# Altium schematic sheet DM0260_CCM.SchDoc: =project_title
size Tabloid; PageSetup: Record=PageOptions|CenterHorizontal=True|CenterVertical=True|PrintScale=0.71|XCorrection=1.00|YCorrection=1.00|PrintKind=0|BorderSize=5000000|LeftOffset=0|BottomOffset=0|Orientation=2|PaperLength=1000|PaperWidth=1000|Scale=100|PaperSource=7|PrintQuality=-4|MediaType=1|DitherType=10|PrintScaleMode=1|PaperKind=A4; CompanyName: Luxonis Holding; Organization: Luxonis Holding; Address1: 1925 Harmony Park Drive; Address2: Westminster, CO; Address3: 80234; Address4: United States; SheetNumber: 3; SheetTotal: 3
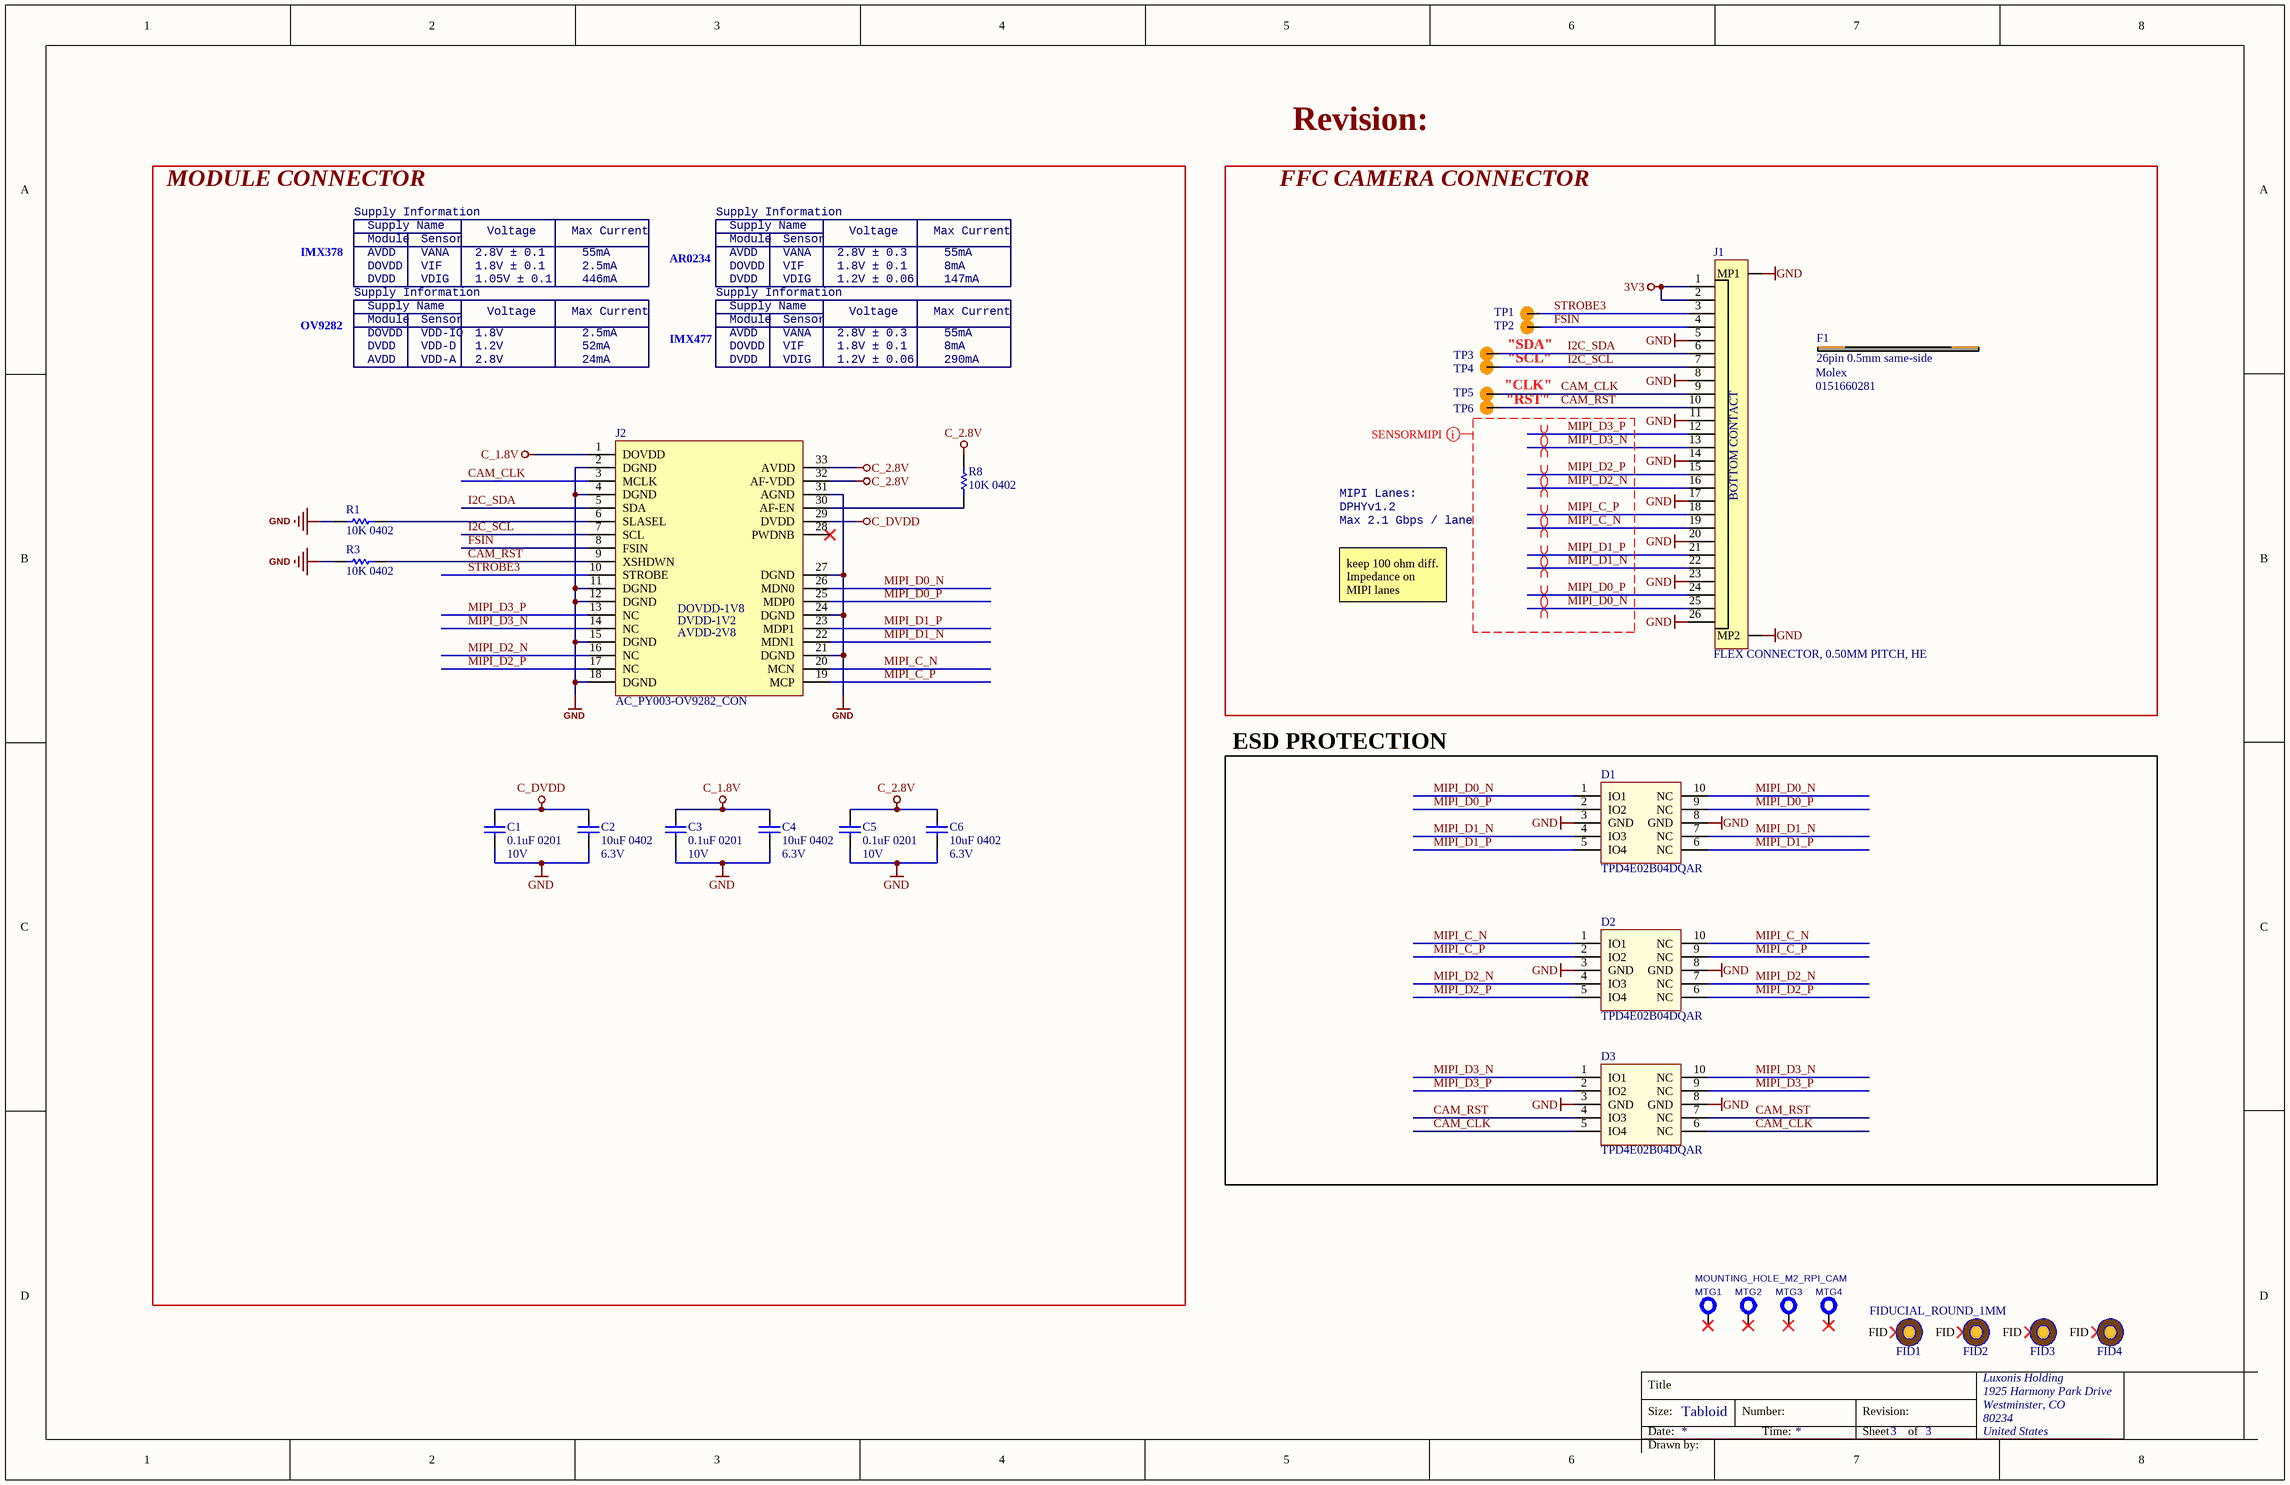
[diagram p0: DM0260_CCM.SchDoc]

## Parts
C1  0.1uF 0201  Voltage: 10V  [CAPC0201(0603)33_L]
C2  10uF 0402  Voltage Rating: 6.3V  [CAPC0402(1005)70_L]
C3  0.1uF 0201  Voltage: 10V  [CAPC0201(0603)33_L]
C4  10uF 0402  Voltage Rating: 6.3V  [CAPC0402(1005)70_L]
C5  0.1uF 0201  Voltage: 10V  [CAPC0201(0603)33_L]
C6  10uF 0402  Voltage Rating: 6.3V  [CAPC0402(1005)70_L]
D1  TPD4E02B04DQAR  [TPD4E02B04DQAR]
D2  TPD4E02B04DQAR  [TPD4E02B04DQAR]
D3  TPD4E02B04DQAR  [TPD4E02B04DQAR]
F1  26pin 0.5mm same-side  Manufacturer 1: Molex  (mechanical)
FID1  FIDUCIAL_ROUND_1MM  [FIDUCIAL_ROUND_1MM]  (no BOM)
FID2  FIDUCIAL_ROUND_1MM  [FIDUCIAL_ROUND_1MM]  (value not drawn)  (no BOM)
FID3  FIDUCIAL_ROUND_1MM  [FIDUCIAL_ROUND_1MM]  (value not drawn)  (no BOM)
FID4  FIDUCIAL_ROUND_1MM  [FIDUCIAL_ROUND_1MM]  (value not drawn)  (no BOM)
J1  FLEX CONNECTOR, 0.50MM PITCH, HE  [F32R-1A7H1-11026]
J2  AC_PY003-OV9282_CON  [AC-PY003-OV9282]
MTG1  MOUNTING_HOLE_M2_RPI_CAM  [MOUNTING_HOLE_M2_RPI_CAM]  (no BOM)
MTG2  MOUNTING_HOLE_M2_RPI_CAM  [MOUNTING_HOLE_M2_RPI_CAM]  (value not drawn)  (no BOM)
MTG3  MOUNTING_HOLE_M2_RPI_CAM  [MOUNTING_HOLE_M2_RPI_CAM]  (value not drawn)  (no BOM)
MTG4  MOUNTING_HOLE_M2_RPI_CAM  [MOUNTING_HOLE_M2_RPI_CAM]  (value not drawn)  (no BOM)
R1  10K 0402  [RESC0402(1005)_L]
R3  10K 0402  [RESC0402(1005)_L]
R8  10K 0402  [RESC0402(1005)_L]
TP1  TP100_200_NS  [TP100_200_NS]  (value not drawn)  (no BOM)
TP2  TP100_200_NS  [TP100_200_NS]  (value not drawn)  (no BOM)
TP3  TP100_200_NS  [TP100_200_NS]  (value not drawn)  (no BOM)
TP4  TP100_200_NS  [TP100_200_NS]  (value not drawn)  (no BOM)
TP5  TP100_200_NS  [TP100_200_NS]  (value not drawn)  (no BOM)
TP6  TP100_200_NS  [TP100_200_NS]  (value not drawn)  (no BOM)

## Blocks framed on the sheet
MODULE CONNECTOR: C1-C6 J2 R1 R3 R8
FFC CAMERA CONNECTOR: F1 J1 TP1-TP6
ESD PROTECTION: D1-D3

## Nets
3V3: J1.1 J1.2
C_1.8V: C3.2 C4.2 J2.1(DOVDD)
C_2.8V: C5.2 C6.2 J2.32(AF-VDD) J2.33(AVDD) R8.2
C_DVDD: C1.2 C2.2 J2.29(DVDD)
GND: C1.1 C2.1 C3.1 C4.1 C5.1 C6.1 D1.3(GND) D1.8(GND) D2.3(GND) D2.8(GND) D3.3(GND) D3.8(GND) J1.5 J1.8 J1.11 J1.14 J1.17 J1.20 J1.23 J1.26 J1.MP1 J1.MP2 J2.2(DGND) J2.4(DGND) J2.11(DGND) J2.12(DGND) J2.15(DGND) J2.18(DGND) J2.21(DGND) J2.24(DGND) J2.27(DGND) J2.31(AGND) R1.1 R3.1
CAM_CLK: D3.5(IO4) D3.6(NC) J1.9 J2.3(MCLK) TP5.1
CAM_RST: D3.4(IO3) D3.7(NC) J1.10 J2.9(XSHDWN) R3.2 TP6.1
FSIN: J1.4 J2.8(FSIN) TP2.1
I2C_SCL: J1.7 J2.7(SCL) TP4.1
I2C_SDA: J1.6 J2.5(SDA) TP3.1
MIPI_C_N: D2.1(IO1) D2.10(NC) J1.19 J2.20(MCN)
MIPI_C_P: D2.2(IO2) D2.9(NC) J1.18 J2.19(MCP)
MIPI_D0_N: D1.1(IO1) D1.10(NC) J1.25 J2.26(MDN0)
MIPI_D0_P: D1.2(IO2) D1.9(NC) J1.24 J2.25(MDP0)
MIPI_D1_N: D1.4(IO3) D1.7(NC) J1.22 J2.22(MDN1)
MIPI_D1_P: D1.5(IO4) D1.6(NC) J1.21 J2.23(MDP1)
MIPI_D2_N: D2.4(IO3) D2.7(NC) J1.16 J2.16(NC)
MIPI_D2_P: D2.5(IO4) D2.6(NC) J1.15 J2.17(NC)
MIPI_D3_N: D3.1(IO1) D3.10(NC) J1.13 J2.14(NC)
MIPI_D3_P: D3.2(IO2) D3.9(NC) J1.12 J2.13(NC)
STROBE3: J1.3 J2.10(STROBE) TP1.1
NetJ2_6: J2.6(SLASEL) R1.2
NetJ2_30: J2.30(AF-EN) R8.1

Not connected (* = marked no-connect by the designer): FID1 FID*; FID2 FID*; FID3 FID*; FID4 FID*; J2 28(PWDNB)*; MTG1 1*; MTG2 1*; MTG3 1*; MTG4 1*

## Layout directives
net class SENSORMIPI: MIPI_C_N, MIPI_C_P, MIPI_D0_N, MIPI_D0_P, MIPI_D1_N, MIPI_D1_P, MIPI_D2_N, MIPI_D2_P, MIPI_D3_N, MIPI_D3_P
differential pair; differential pair class 100ohm: MIPI_C_N, MIPI_C_P, MIPI_D0_N, MIPI_D0_P, MIPI_D1_N, MIPI_D1_P, MIPI_D2_N, MIPI_D2_P, MIPI_D3_N, MIPI_D3_P

## Notes on the sheet
- Revision:
- Supply Information
- Supply Name
- Voltage
- Max Current
- IMX378
- AVDD
- DOVDD
- DVDD
- Module
- VANA
- VIF
- VDIG
- Sensor
- 2.8V ± 0.1
- 1.8V ± 0.1
- 1.05V ± 0.1
- 55mA
- 2.5mA
- 446mA
- AR0234
- 2.8V ± 0.3
- 1.2V ± 0.06
- 8mA
- 147mA
- OV9282
- VDD-A
- VDD-IO
- VDD-D
- 2.8V
- 1.8V
- 1.2V
- 24mA
- 52mA
- IMX477
- 290mA
- "SCL"
- "SDA"
- "CLK"
- "RST"
- MIPI Lanes:
- Max 2.1 Gbps / lane
- DPHYv1.2
- keep 100 ohm diff. Impedance on MIPI lanes
- Title
- Size:
- Date:
- Tabloid
- Number:
- Time:
- Sheet
- of
- Drawn by:
- (in symbol CMP-005-000036-1) DOVDD-1V8; DVDD-1V2; AVDD-2V8
- (in symbol F32R-1A7H1-11026) BOTTOM CONTACT

## Library data of the parts
C1 C3 C5 = GRM033R61A104KE15D: CAP CER 0.1UF 10V X5R 0201; Manufacturer 1: Murata; Capacitance: 100nF; Tolerance: 10%; Supplier 1: Digi-Key; Manufacturer Part Number 1: GRM033R61A104KE15D; Stock 1: 45335312; Pricing 1: 1=0.10000, 10=0.04200, 100=0.01860, 500=0.01330, 1000=0.01045, 2500=0.00950, 5000=0.00874 (USD); RoHS: Yes; Mount: Surface Mount; Case/Package: 0201; Weight: 6E-06oz; Case Code (Metric): 0603; Case Code (Imperial): 0201; Min Operating Temperature: -55°C; Max Operating Temperature: 85°C; Packaging: Tape and Reel; Voltage Rating: 10V; Package Quantity: 1; Voltage Rating (DC): 10V; Dielectric: X5R; Termination: SMD/SMT; Length: 0.6mm; Height: 0.3mm; Width: 0.012inch; Thickness: 0.013inch; Depth: 0.3mm; Radiation Hardening: No; Lead Free: Lead Free; REACH SVHC: No SVHC; ComponentLink1URL: https://datasheet.ciiva.com/26843/getdatasheetpartid-308656-26843739.pdf?src-supplier=Verical; ComponentLink1Description: https://datasheet.ciiva.com/26843/getdatasheetpartid-308656-26843739.pdf?src-supplier=Verical; ComponentLink2URL: https://datasheet.ciiva.com/5413/product-5413117.pdf?src-supplier=Mouser; ComponentLink2Description: https://datasheet.ciiva.com/5413/product-5413117.pdf?src-supplier=Mouser; ComponentLink3URL: https://datasheet.ciiva.com/6256/partnumbering-e-01-6256406.pdf?src-supplier=Digi-Key; ComponentLink3Description: https://datasheet.ciiva.com/6256/partnumbering-e-01-6256406.pdf?src-supplier=Digi-Key; ComponentLink4URL: https://datasheet.ciiva.com/6256/partnumbering-e-01-6256407.pdf?src-supplier=Digi-Key; ComponentLink4Description: https://datasheet.ciiva.com/6256/partnumbering-e-01-6256407.pdf?src-supplier=Digi-Key; ComponentLink5URL: https://datasheet.ciiva.com/6256/partnumbering-e-01-6256408.pdf?src-supplier=Digi-Key; ComponentLink5Description: https://datasheet.ciiva.com/6256/partnumbering-e-01-6256408.pdf?src-supplier=Digi-Key; Supplier Part Number 1: 490-5881-1-ND
C2 C4 C6 = GRM155R60J106ME15D: CAP CER 10UF 6.3V X5R 0402 20%; Manufacturer 1: Murata; Supplier 1: Digi-Key; Manufacturer Part Number 1: GRM155R60J106ME15D; Stock 1: 1839627; Pricing 1: 1=0.23000, 10=0.15700, 100=0.07950, 500=0.05442, 1000=0.04814, 2500=0.04605, 5000=0.04186 (USD); RoHS: Yes; Mount: Surface Mount; Case/Package: 0402; Case Code (Metric): 1005; Case Code (Imperial): 0402; Min Operating Temperature: -55°C; Max Operating Temperature: 85°C; Packaging: Tape and Reel; Capacitance: 10uF; Dielectric: X5R; Length: 0.039inch; Width: 0.02inch; ComponentLink1URL: https://www.murata.com/~/media/webrenewal/support/library/catalog/products/capacitor/mlcc/c02e.ashx?la=en-us&src-supplier=Digi-Key; ComponentLink1Description: https://www.murata.com/~/media/webrenewal/support/library/catalog/products/capacitor/mlcc/c02e.ashx?la=en-us&src-supplier=Digi-Key; Supplier Part Number 1: 490-13238-1-ND; Voltage Rating (DC): 6.3V; Thickness: 0.026inch; Tolerance: 20%
D1-D3 = TPD4E02B04DQAR: TVS DIODE 3.6V 8.8V 10USON 8.8V (Typ) Clamp 5A (8/20µs) Ipp Tvs Diode Surface Mount 10-USON (2.5x1); Manufacturer 1: Texas Instruments; Number of Bidirectional Channels: 4; Min Breakdown Voltage: 5.5V; Peak Pulse Power: 17W; Power Line Protection: No; Interface: USB,HDMI; Supplier 1: Digi-Key; Manufacturer Part Number 1: TPD4E02B04DQAR; Stock 1: 25615; Pricing 1: 1=0.69000, 10=0.60800, 100=0.46650, 500=0.36874, 1000=0.29499 (USD); RoHS: Yes; Mount: Surface Mount; Number of Pins: 10; Min Operating Temperature: -40°C; Max Operating Temperature: 125°C; Packaging: Cut Tape; Reverse Standoff Voltage: 3.6V; Clamping Voltage: 8.8V; Operating Supply Voltage: 3.6V; Peak Pulse Current: 5A; Number of Channels: 4; Composition: Zener; REACH SVHC: No SVHC; Lead Free: Lead Free; ComponentLink1URL: http://www.ti.com/general/docs/lit/getliterature.tsp?genericPartNumber=TPD4E02B04&amp;&amp;fileType=pdf&src-supplier=Element14; ComponentLink1Description: http://www.ti.com/general/docs/lit/getliterature.tsp?genericPartNumber=TPD4E02B04&amp;&amp;fileType=pdf&src-supplier=Element14; ComponentLink2URL: http://www.ti.com/lit/ds/symlink/tpd4e02b04.pdf?src-supplier=Farnell; ComponentLink2Description: http://www.ti.com/lit/ds/symlink/tpd4e02b04.pdf?src-supplier=Farnell; ComponentLink3URL: http://www.ti.com/lit/ds/symlink/tpd4e02b04.pdf?src-supplier=Newark; ComponentLink3Description: http://www.ti.com/lit/ds/symlink/tpd4e02b04.pdf?src-supplier=Newark; ComponentLink4URL: http://www.ti.com/lit/ds/symlink/tpd4e02b04.pdf?src-supplier=Digi-Key; ComponentLink4Description: http://www.ti.com/lit/ds/symlink/tpd4e02b04.pdf?src-supplier=Digi-Key; Supplier Part Number 1: 296-43875-1-ND
F1 = 0151660281: CABLE FFC 26POS 0.50MM 6"; Number of Conductors: 26; Wire/Cable Type: Flat Flex; Pitch: 0.02inch; Supplier 1: Digi-Key; Manufacturer Part Number 1: 0151660281; Stock 1: 118; Pricing 1: 1=2.21000, 10=2.01000, 25=1.88680, 50=1.80460, 100=1.72260, 250=1.55856, 500=1.43552, 1000=1.23045, 2500=1.14842 (USD); RoHS: Yes; Number of Pins: 26; Packaging: Bulk; Package Quantity: 1000; Length: 6inch; Cable Pitch: 0.5mm; Radiation Hardening: No; ComponentLink1URL: https://datasheet.ciiva.com/10989/0151660281-cable-10989152.pdf?src-supplier=Avnet; ComponentLink1Description: https://datasheet.ciiva.com/10989/0151660281-cable-10989152.pdf?src-supplier=Avnet; ComponentLink2URL: https://datasheet.ciiva.com/2944/151660051-sd-2944673.pdf?src-supplier=Digi-Key; ComponentLink2Description: https://datasheet.ciiva.com/2944/151660051-sd-2944673.pdf?src-supplier=Digi-Key; Supplier 2: Mouser; Supplier Part Number 1: WM11334-ND; Supplier Part Number 2: 538-15166-0281
FID1-FID4 = FIDUCIAL: Fiducial with various available footprints
J1 = F32R-1A7H1-11026: 26 Position FFC, FPC Connector Contacts, Bottom 0.020" (0.50mm) Surface Mount, Right Angle; Manufacturer 1: Amphenol ICC (FCI); Number of Positions: 26; Voltage Rating: 50V; Current Rating: 500mA; Pitch: 0.02inch; Supplier 1: Digi-Key; Manufacturer Part Number 1: F32R-1A7H1-11026; RoHS: Yes; Category: Connectors; Pricing 1: 1=0.77, 10=0.721, 100=0.5529, 500=0.4808 (USD); Mount: Surface Mount; Contact Plating: Tin; Contact Material: Bronze; Min Operating Temperature: -40°C; Max Operating Temperature: 105°C; Packaging: Tape and Reel; Termination: Solder; Flammability Rating: UL94 V-0; ComponentLink1URL: https://cdn.amphenol-icc.com/media/wysiwyg/files/drawing/f32r-f32j.pdf; ComponentLink1Description: https://cdn.amphenol-icc.com/media/wysiwyg/files/drawing/f32r-f32j.pdf; Stock 1: 1709; Supplier Part Number 1: 609-F32R-1A7H1-11026CT-ND
J2 = CMP-005-000036-1: FFC/FPC Connector, 33 Contact(s), 1 Row(s), Female, Right Angle, Surface Mount Terminal; Manufacturer 1: Hirose; Manufacturer Part Number 1: FH26W-33S-0.3SHW(60); ComponentLink1Description: https://datasheet.ciiva.com:443/pdfs/VipMasterIC/IC/HIRO/HIRO-S-A0007913874/HIRO-S-A0008593114-1.pdf?src-supplier=IHS+Markit; ComponentLink3Description: https://www.hirose.com/product/download/?distributor=digikey&amp;type=2d&amp;lang=en&amp;num=FH26W-13S-0.3SHW(60)&src-supplier=Digi-Key; ComponentLink1URL: https://datasheet.ciiva.com:443/pdfs/VipMasterIC/IC/HIRO/HIRO-S-A0007913874/HIRO-S-A0008593114-1.pdf?src-supplier=IHS+Markit; Source: LuxonisMaster.SchLib; ComponentLink2Description: https://www.hirose.com/product/en/download_file/key_name/FH26/category/Catalog/doc_file_id/49355/?file_category_id=4&item_id=298&is_series=1&src-supplier=Digi-Key; Pricing 1: 1=1,78000, 10=1,61700, 25=1,51800, 50=1,45200, 100=1,38600, 250=1,25400, 500=1,15500, 1000=0,99000, 2500=0,92400 (USD); Category: FFC / FPC; Design Item ID: AC_PY003-OV9282_CON; ComponentLink2URL: https://www.hirose.com/product/en/download_file/key_name/FH26/category/Catalog/doc_file_id/49355/?file_category_id=4&item_id=298&is_series=1&src-supplier=Digi-Key; RoHS: Yes; Stock 1: 627; ComponentLink3URL: https://www.hirose.com/product/download/?distributor=digikey&amp;type=2d&amp;lang=en&amp;num=FH26W-13S-0.3SHW(60)&src-supplier=Digi-Key
MTG1-MTG4 = MP_Mounting-Holes: =CurrentFootprint; B - Value: Not a Part; A - Level: 0
R1 R3 R8 = RC0402FR-1310KL: RES SMD 10K OHM 1% 0402 1/16W Chip Resistor, 0402 [1005 Metric], 10 kohm, RC Series, 50 V, Thick Film, 62.5 mW; Manufacturer 1: Yageo; Resistance: 10kR; Temperature Coefficient: 100ppm/°C; Power Rating: 62.5mW; Voltage Rating: 50V; ComponentLink1URL: https://datasheet.ciiva.com/16940/pyu-rc0402-51-rohs-l-6-16940293.pdf?src-supplier=Avnet+Europe; ComponentLink1Description: https://datasheet.ciiva.com/16940/pyu-rc0402-51-rohs-l-6-16940293.pdf?src-supplier=Avnet+Europe; ComponentLink2URL: https://datasheet.ciiva.com/28386/pyu-rc0402-51-rohs-l-6-28386855.pdf?src-supplier=Avnet+Europe; ComponentLink2Description: https://datasheet.ciiva.com/28386/pyu-rc0402-51-rohs-l-6-28386855.pdf?src-supplier=Avnet+Europe; ComponentLink3URL: https://datasheet.ciiva.com/16740/pyu-rc0402-51-rohs-l-6-r-16740602.pdf?src-supplier=Future+Electronics; ComponentLink3Description: https://datasheet.ciiva.com/16740/pyu-rc0402-51-rohs-l-6-r-16740602.pdf?src-supplier=Future+Electronics; ComponentLink4URL: https://datasheet.ciiva.com/8891/pyu-rc0402-51-rohs-l-6-8891339.pdf?src-supplier=Avnet; ComponentLink4Description: https://datasheet.ciiva.com/8891/pyu-rc0402-51-rohs-l-6-8891339.pdf?src-supplier=Avnet; ComponentLink5URL: https://datasheet.ciiva.com/5557/pyu-rc0402-51-rohs-l-6-r-5557997.pdf?src-supplier=Mouser; ComponentLink5Description: https://datasheet.ciiva.com/5557/pyu-rc0402-51-rohs-l-6-r-5557997.pdf?src-supplier=Mouser; ComponentLink6URL: https://datasheet.ciiva.com/7983/1018594-7983533.pdf?src-supplier=Element14; ComponentLink6Description: https://datasheet.ciiva.com/7983/1018594-7983533.pdf?src-supplier=Element14; Supplier 1: Newark; Manufacturer Part Number 1: RC0402FR-1310KL; Stock 1: 62239; Pricing 1: 1=0.10000, 25=0.01200, 100=0.00400, 250=0.00400, 500=0.00300, 1000=0.00300 (USD); RoHS: Yes; Case/Package: 0402; Number of Pins: 2; Contact Plating: Tin,Matte,Lead; Case Code (Imperial): 0402; Case Code (Metric): 1005; Min Operating Temperature: -55°C; Max Operating Temperature: 155°C; Tolerance: 1%; Composition: Thick Film; Packaging: Tape and Reel; Termination: SMD/SMT; Military Standard: Not; Voltage Rating (DC): 50V; Working Voltage: 50V; Number of Terminations: 2; Length: 1mm; Depth: 0.5mm; Radiation Hardening: No; REACH SVHC: No SVHC; Lead Free: Lead Free; Supplier Part Number 1: 67R9960; Supplier 2: Future Electronics; Supplier 3: Mouser; Supplier 4: Element14; Supplier Part Number 2: RC0402FR-1310KL-CUTT; Supplier Part Number 3: 603-RC0402FR-1310KL; Supplier Part Number 4: 1799235
TP1-TP6 = TEST_POINT